# EAGLE schematic Adafruit MAX4466 Mic Amp (EAGLE 9.6.2)
AUTHOR: K. Townsend
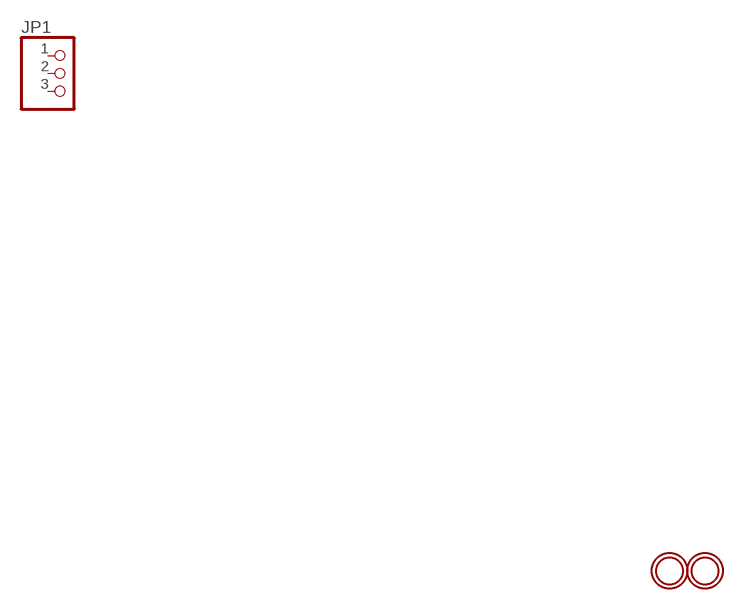
[diagram p0: schematic, sheet 1]

## Parts
JP1  HEADER-1X376MIL  [1X03_ROUND_76]
U$11  MOUNTINGHOLE2.5  [MOUNTINGHOLE_2.5_PLATED]
U$14  MOUNTINGHOLE2.5  [MOUNTINGHOLE_2.5_PLATED]
Unconnected: JP1.1 JP1.2 JP1.3

## Library data of the parts
JP1 = microbuilder:HEADER-1X3: PIN HEADER
U$11 U$14 = microbuilder:MOUNTINGHOLE: Mounting Hole For #2 screws (0.086"/2.18mm width, 0.094"/2.4mm hole) use 2.5mm